# Altium schematic sheet 平衡充初代结构图.SchDoc
size A4
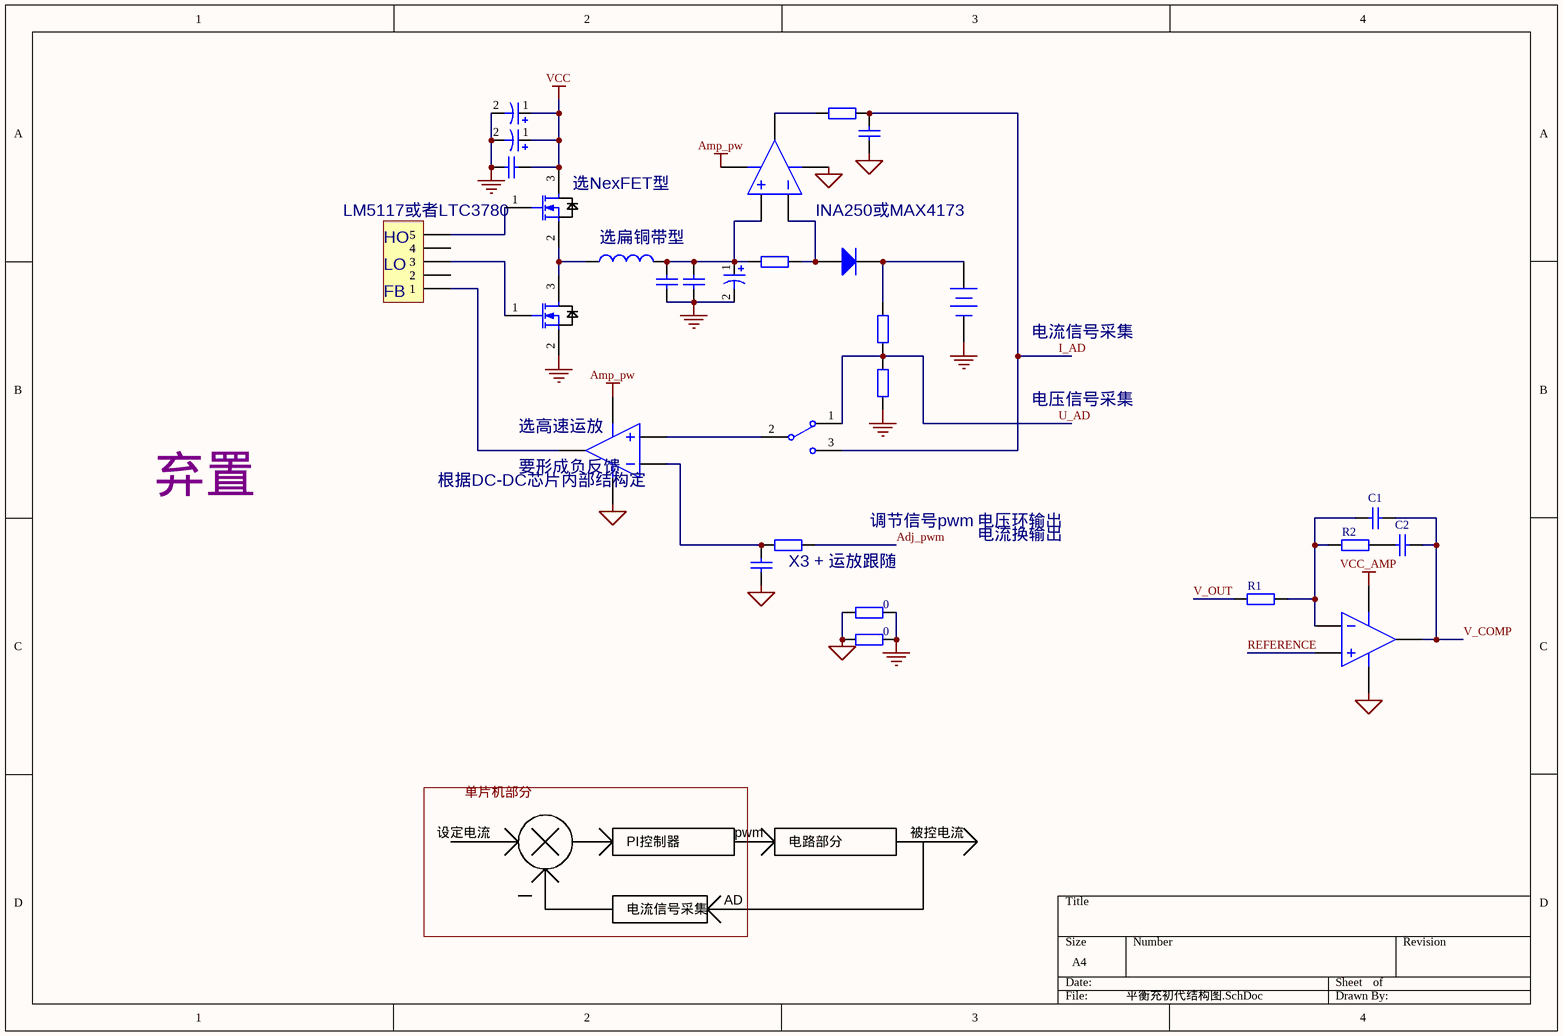
[diagram p0: 平衡充初代结构图.SchDoc]

## Parts
(Parts that share a designator on the sheet are numbered #1, #2 ... from top to bottom, then left to right.)
?#1  Cap(tantalum)  [3528(B)]  (value not drawn)
?#2  Cap  [0603(1608)]  (value not drawn)
?#3  Cap(tantalum)  [3528(B)]  (value not drawn)
?#4  Cap  [0603(1608)]  (value not drawn)
?#5  Inductor  [CD32]  (value not drawn)
?#6  Cap(tantalum)  [3528(B)]  (value not drawn)
?#7  Cap  [0603(1608)]  (value not drawn)
?#8  Cap  [0603(1608)]  (value not drawn)
?#9  Cap  [0603(1608)]  (value not drawn)
AR?#1  运算放大器  [DIP-8N]  (value not drawn)
AR?#2  运算放大器  [DIP-8N]  (value not drawn)
AR?#3  运算放大器  [DIP-8N]  (value not drawn)
BT?  Battery  (value not drawn)
C1  Cap  [0603(1608)]  (value not drawn)
C2  Cap  [0603(1608)]  (value not drawn)
DIO?  Diode  [DIODE-1206]  (value not drawn)
P?  Header 5  [HDR1X5]  (value not drawn)
Q?#1  mos  [SOT-23(ME6206A/BAT54C/SI2302)]  (value not drawn)
Q?#2  mos  [SOT-23(ME6206A/BAT54C/SI2302)]  (value not drawn)
R1  ESR  [0603(1608)]  (value not drawn)
R2  ESR  [0603(1608)]  (value not drawn)
R?#1  Res2  [0603(1608)]  (value not drawn)
R?#2  Res2  [0603(1608)]  (value not drawn)
R?#3  Res2  [0603(1608)]  (value not drawn)
R?#4  Res2  [0603(1608)]  (value not drawn)
R?#5  Res2  [0603(1608)]  (value not drawn)
R?#6  0  [0603(1608)]
R?#7  0  [0603(1608)]
S?  MTS-10x  [MTS-10x]  (value not drawn)

## Nets
A_GND: ?#2.1 ?#9.1 AR?#1.8(V+) AR?#2.8(V+) AR?#3.4(V-) R?#6.2 R?#7.2
Amp_pw: AR?#1.4(V-) AR?#2.4(V-)
GND: ?#1.2 ?#3.2 ?#4.2 ?#6.2 ?#7.1 ?#8.1 BT?.2(-) Q?#2.2(S) R?#4.2 R?#6.1 R?#7.1
VCC: ?#1.1 ?#3.1 ?#4.1 Q?#1.3(D)
VCC_AMP: AR?#3.8(V+)
Adj_pwm: R?#5.2
I_AD: ?#2.2 R?#1.2 S?.3
REFERENCE: AR?#3.3(IN+)
U_AD: R?#3.2 R?#4.1 S?.1
V_COMP: AR?#3.1(OUT) C1.1 C2.1
V_OUT: R1.1
Net?#5_1: ?#5.1 Q?#1.2(S) Q?#2.3(D)
Net?#5_2: ?#5.2 ?#6.1 ?#7.2 ?#8.2 AR?#1.3(IN+) R?#2.2
Net?#9_2: ?#9.2 AR?#2.2(IN-) R?#5.1
NetAR?#1_1: AR?#1.1(OUT) R?#1.1
NetAR?#1_2: AR?#1.2(IN-) DIO?.1(A) R?#2.1
NetAR?#2_1: AR?#2.1(OUT) P?.1
NetAR?#2_3: AR?#2.3(IN+) S?.2
NetAR?#3_2: AR?#3.2(IN-) C1.2 R1.2 R2.1
NetBT?_1: BT?.1(+) DIO?.2(K) R?#3.1
NetC2_2: C2.2 R2.2
NetP?_3: P?.3 Q?#2.1(G)
NetP?_5: P?.5 Q?#1.1(G)

Not connected (* = marked no-connect by the designer): P? 2 4

## Notes on the sheet
- (near P?) LM5117或者LTC3780
- (near P?) HO
- (near Q?#1) 选NexFET型
- (near ?#5) 选扁铜带型
- (near AR?#1) INA250或MAX4173
- (near P?) LO
- (near P?) FB
- 电流信号采集
- (near AR?#2) 选高速运放
- 电压信号采集
- 弃置
- (near AR?#2) 根据DC-DC芯片内部结构定
- (near AR?#2) 要形成负反馈
- (near R?#5) X3 + 运放跟随
- 调节信号pwm
- 电压环输出
- 电流换输出
- 设定电流
- 单片机部分
- PI控制器
- pwm
- 电路部分
- 被控电流
- AD

## Library data of the parts
?#1 ?#3 ?#6 = Cap(tantalum): tantalum capacitor; Value: 100uF
?#2 ?#4 ?#7-?#9 C1 C2 = Cap: Capacitor; Value: 0.1uF; Published: 8-Jun-2000; LatestRevisionDate: 17-Jul-2002; LatestRevisionNote: Re-released for DXP Platform.; PackageReference: RAD-0.3; Publisher: Altium Limited; PackageDescription: Radial Cap, Thru-Hole; 2 Leads; 0.3 in Pin Spacing
?#5 = Inductor: Code_IEC: 1005; Value: 33uH; Published: 8-Jun-2000; LatestRevisionDate: 29-May-2009; LatestRevisionNote: IPC-7351 Footprint Added.; PackageReference: 0402-A; Publisher: Altium Limited; PackageDescription: Chip Inductor; Code_JEITA: 0402
AR?#1-AR?#3 = 运算放大器: Operational Amplifier; U?: *
BT? = Battery: 备份电池; Published: 24-Mar-1999; LatestRevisionDate: 17-Jul-2002; LatestRevisionNote: Re-released for DXP Platform.; PackageReference: BAT-2; Publisher: Altium Limited
DIO? = Diode: 二极管; Published: 8-Jun-2000; LatestRevisionDate: 17-Jul-2002; LatestRevisionNote: Re-released for DXP Platform.; PackageDocument: Sep-1996; PackageReference: SMC; Publisher: Altium Limited; Code_JEDEC: DO-214-AB
P? = Header 5: Header, 5-Pin; LatestRevisionDate: 17-Jul-2002; LatestRevisionNote: Re-released for DXP Platform.; Publisher: Altium Limited
Q?#1 Q?#2 = SI2302
R1 R2 R?#1-R?#7 = Res2: Resistor; Value: 10K; Published: 8-Jun-2000; LatestRevisionDate: 17-Jul-2002; LatestRevisionNote: Re-released for DXP Platform.; PackageReference: AXIAL-0.4; Publisher: Altium Limited; PackageDescription: Axial Device, Thru-Hole; 2 Leads; 0.4 in Pin Spacing
S? = MTS-10x: MTS10x系列3脚扭子开关; 版权归属: 源创客; BOM名称: MTS10x系列3脚扭子开关; 学习资源: www.ooocke.com